# Altium schematic sheet Main.SchDoc
size A; DocumentNumber: 1; SheetNumber: 1; SheetTotal: 5
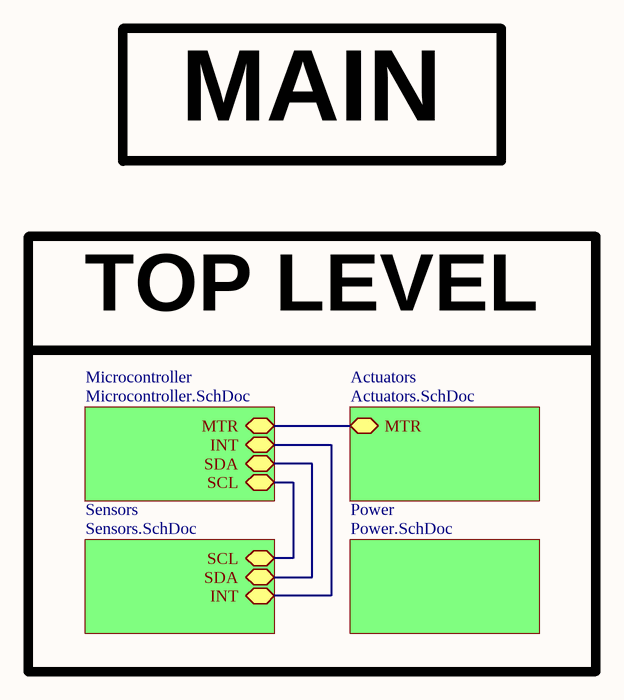
[diagram p0: Main.SchDoc]

## Sub-sheets
Actuators = Actuators.SchDoc: MTR
Microcontroller = Microcontroller.SchDoc: MTR, INT, SDA, SCL
Power = Power.SchDoc: no entries
Sensors = Sensors.SchDoc: INT, SDA, SCL

## Nets
(unnamed): sheet Actuators/MTR, sheet Microcontroller/MTR
(unnamed): sheet Microcontroller/INT, sheet Sensors/INT
(unnamed): sheet Microcontroller/SDA, sheet Sensors/SDA
(unnamed): sheet Microcontroller/SCL, sheet Sensors/SCL

## Notes on the sheet
- MAIN
- TOP LEVEL